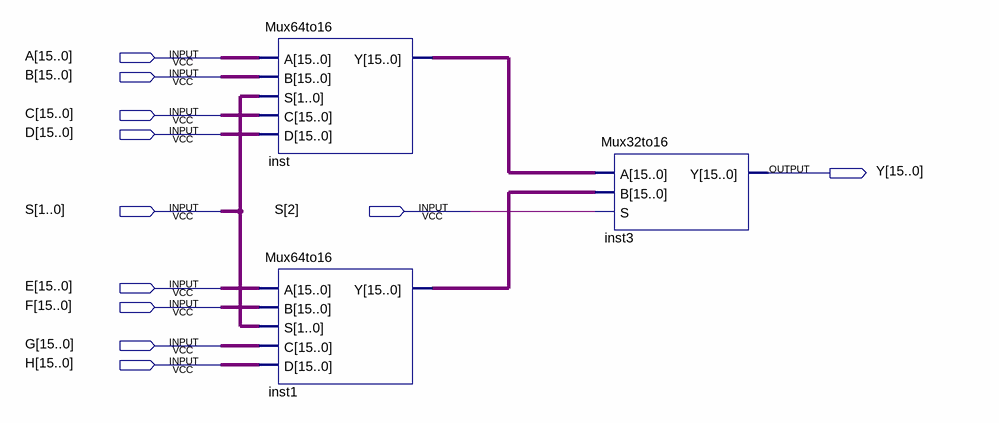
[diagram p0: schematic sheet]
// Quartus schematic 2_mux64to16.bdf as structural Verilog: 3 symbols, 11 pins
module \2_mux64to16  (
  input  [15:0] A,
  input  [15:0] B,
  input  [15:0] C,
  input  [15:0] D,
  input  [2:0] S,
  input  [15:0] E,
  input  [15:0] F,
  input  [15:0] G,
  input  [15:0] H,
  output [15:0] Y
);

  wire [15:0] inst1_y, inst_y;

  Mux64to16 inst (.A(A), .B(B), .S(S[1:0]), .C(C), .D(D), .Y(inst_y));
  Mux64to16 inst1 (.A(E), .B(F), .S(S[1:0]), .C(G), .D(H), .Y(inst1_y));
  Mux32to16 inst3 (.A(inst_y), .B(inst1_y), .S(S[2]), .Y(Y));
endmodule
